# EAGLE design dasblinkenhat-controller-mk-1.1 (EAGLE 7.5.0)
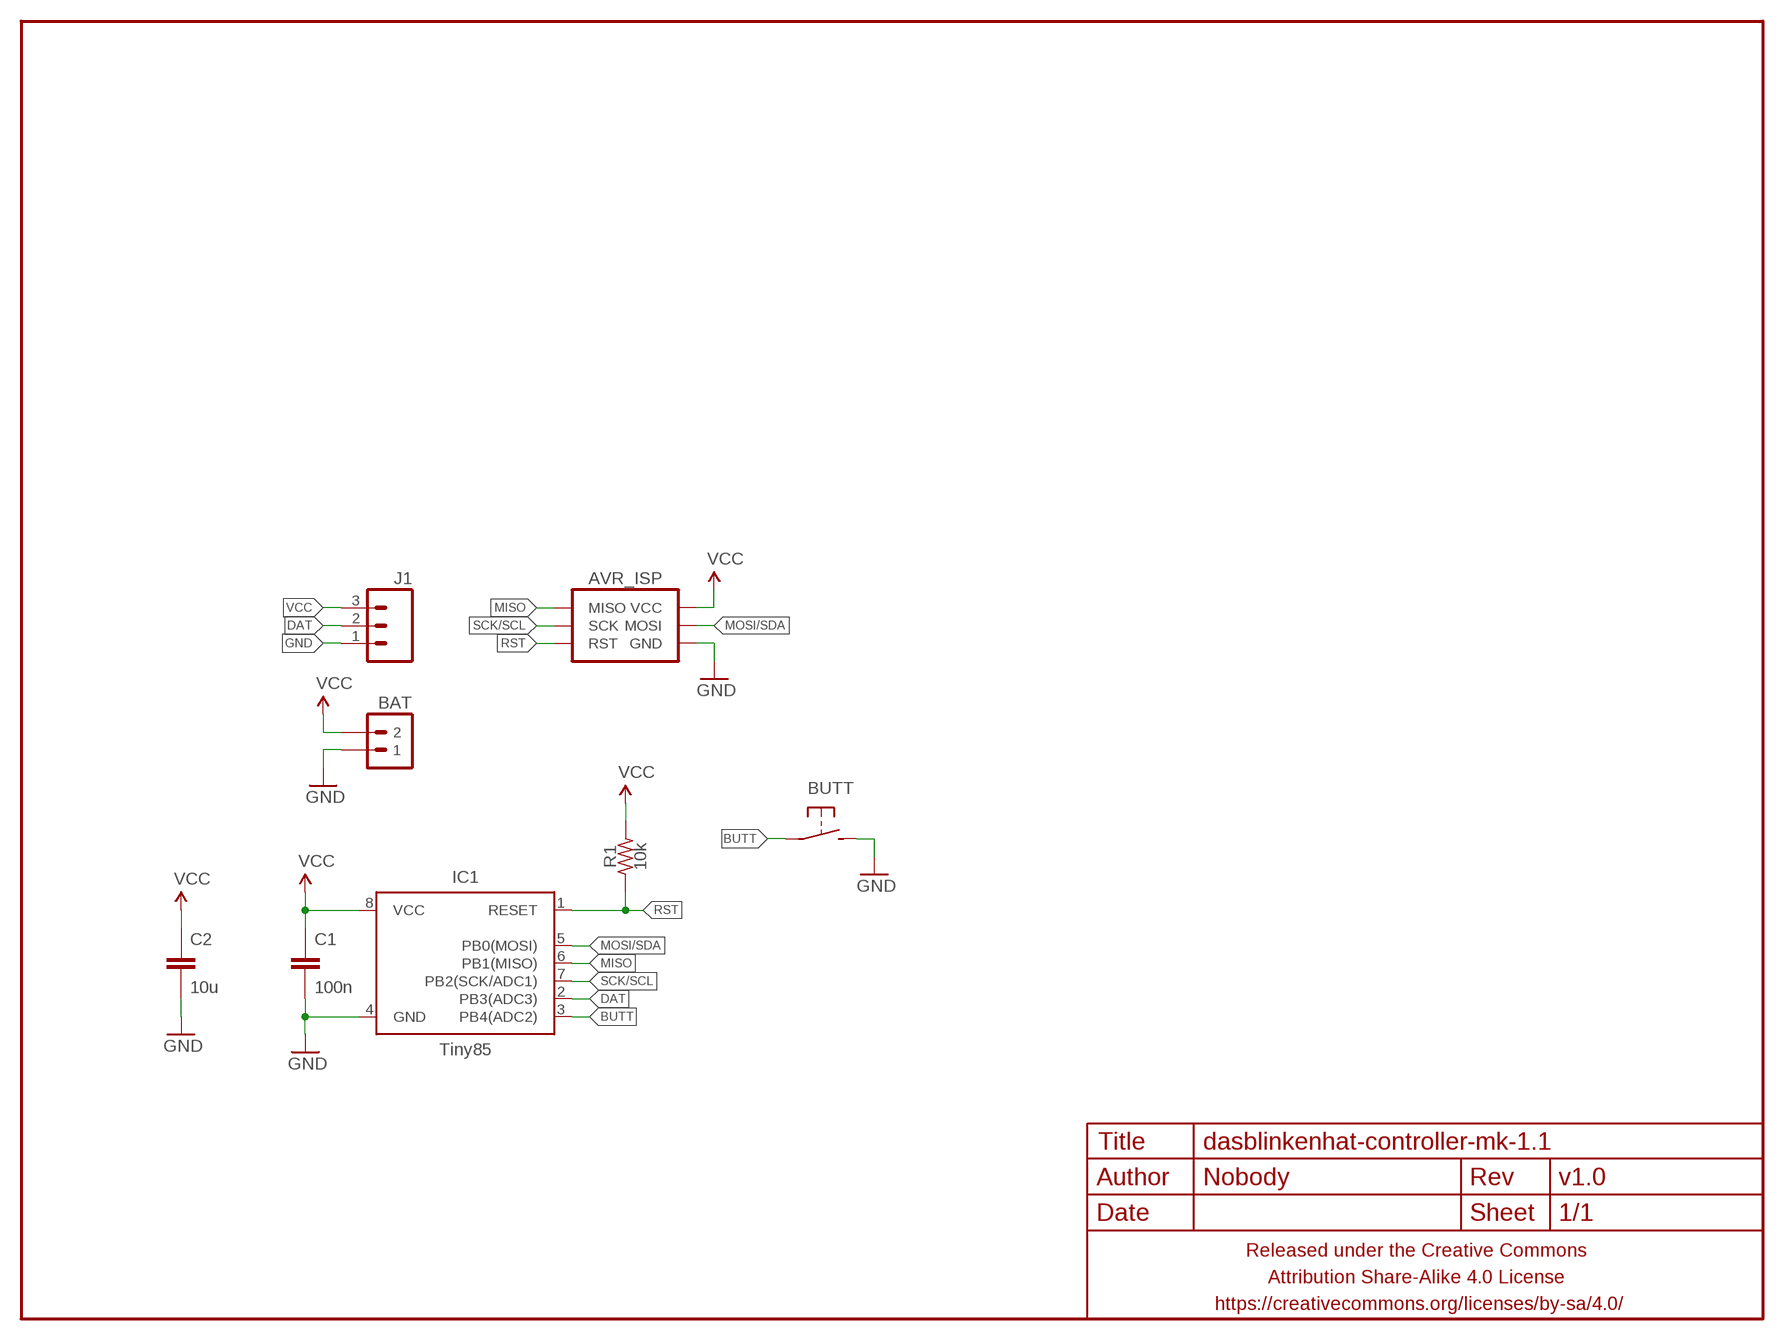
[diagram p0: schematic, sheet 1]

## Parts
AVR_ISP  AVR_SPI_PRG_6TESTPOINTS  [2X3_TEST_POINTS]
BAT  M02JST-2MM-SMT  [JST-2-SMD]
BUTT  DTS-6MM  SPST-NO-TACTSMD-TINY  [TACTILE-SWITCH-SMD]
C1  100n  CAPACITOR-CERAMICC0603  [C0603]
C2  10u  CAPACITOR-CERAMICC0805  [C0805]
FRAME1  FRAME-LETTERNO_PACKAGE  [DUMMY]
IC1  Tiny85  ATTINY45TINY85-20-SOICW  [SO08-EIAJ]
J1  M03JST-XH-RA-PTH  [JST-3-XH-RA-PTH]
R1  10k  RESISTORR0603  [R0603]

## Nets
BUTT: BUTT.A@1 BUTT.A@2 IC1.3(PB4(ADC2))
DAT: IC1.2(PB3(ADC3)) J1.2
GND: AVR_ISP.6(GND) BAT.2 BUTT.B@1 BUTT.B@2 C1.2 C2.2 IC1.4(GND) J1.1
MISO: AVR_ISP.1(MISO) IC1.6(PB1(MISO))
MOSI/SDA: AVR_ISP.4(MOSI) IC1.5(PB0(MOSI))
RST: AVR_ISP.5(RST) IC1.1(RESET) R1.1
SCK/SCL: AVR_ISP.3(SCK) IC1.7(PB2(SCK/ADC1))
VCC: AVR_ISP.2(VCC) BAT.1 C1.1 C2.1 IC1.8(VCC) J1.3 R1.2

## Library data of the parts
AVR_ISP = A_butts:AVR_SPI_PRG_6: AVR ISP 6 Pin This is the reduced ISP connector for AVR programming. Common on Arduino. This footprint will take up less PCB space and can be used with a 10-pin to 6-pin adapter such as SKU: BOB-08508 **Special note about "TEST_POINT" package. The stop mask is on the top side, so if you want your programming test points to be on the bottom of your board, make sure to place this package on the bottom side of the board. This also ensure that the orientation to program from the bottom side will be correct.
BAT = a_parts:M02: Standard 2-pin 0.1" header. Use with - straight break away headers ( PRT-00116) - right angle break away headers (PRT-00553) - swiss pins (PRT-00743) - machine pins (PRT-00117) - female headers (PRT-00115) Molex polarized connector foot print use with: PRT-08233 with associated crimp pins and housings. 2.54_SCREWTERM for use with PRT-10571. 3.5mm Screw Terminal footprints for PRT-08084 5mm Screw Terminal footprints for use with PRT-08433; PROD_ID: CONN-08352
BUTT = A_butts:SPST-NO-TACT
C1 C2 = A_butts:CAPACITOR-CERAMIC: CAPACITOR, European symbol
FRAME1 = a_parts:FRAME-LETTER: Schematic Frame Standard 8.5x11 US Letter frame; DESIGNER: Nobody; VERSION: v1.0
IC1 = A_butts:ATTINY45: Atmel 8-pin 2/4/8kB flash uC; PROD_ID: IC-09092; VALUE: Tiny85-20-SMT
J1 = a_parts:M03: Header 3 Standard 3-pin 0.1" header. Use with straight break away headers (SKU : PRT-00116), right angle break away headers (PRT-00553), swiss pins (PRT-00743), machine pins (PRT-00117), and female headers (PRT-00115). Molex polarized connector foot print use with SKU : PRT-08232 with associated crimp pins and housings.
R1 = A_butts:RESISTOR: RESISTOR, American symbol

## Board
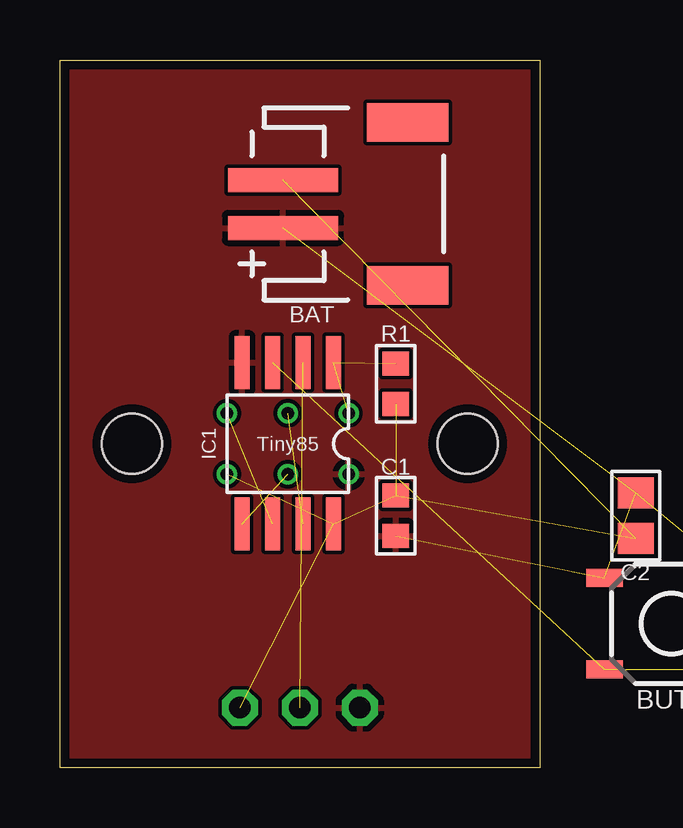
[diagram p1: board, top side]
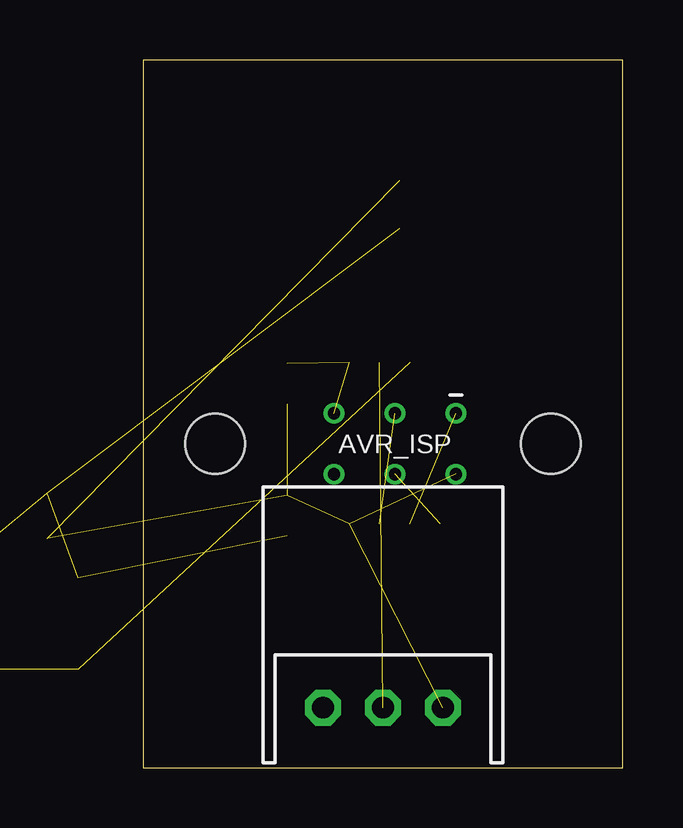
[diagram p2: board, bottom side, seen from below]

Size 20 x 29.5 mm. Coordinates in mm from the lower left corner, seen from the top.
Outline: 0,0 0,29.5 20,29.5 20,0 0,0
Copper layers (1*16): Top 0.0356mm / dielectric 1.5011mm / Bottom 0.0356mm
Design rules "LaenPCBOrder2": minimum track width 6mil, minimum drill 13mil, track to track 6mil, track to pad 6mil, pad to pad 6mil, via to via 6mil, smd to smd 6mil, copper to edge 15mil, drill to drill 6mil, minimum pad ring 7mil, minimum via ring 7mil, stop-mask expansion 3mil, vias tented up to drill 20mil, thermal gap 10mil
Holes 2.5 mm at 3,13.5 17,13.5

### Footprints (pad centres in the part's own frame; a part is rotated, then mirrored left to right if it is on the bottom)
2X3_TEST_POINTS = drill 0.508: 1 -2.54,-1.27; 2 -2.54,1.27; 3 0,-1.27; 4 0,1.27; 5 2.54,-1.27; 6 2.54,1.27
JST-2-SMD = smd 1 x 4.6: 1 -1,-3.7; 2 1,-3.7 | smd 1.6 x 3.4: NC1 -3.4,1.5; NC2 3.4,1.5
TACTILE-SWITCH-SMD = smd 1.524 x 0.762: A@1 -2.794,1.905; A@2 2.794,1.905; B@1 -2.794,-1.905; B@2 2.794,-1.905
C0603 = smd 1 x 1.1: 1 -0.85,0; 2 0.85,0
C0805 = smd 1.3 x 1.5: 1 -0.95,0; 2 0.95,0
SO08-EIAJ = smd 0.61 x 2.21: 1 -1.905,-3.378; 2 -0.635,-3.378; 3 0.635,-3.378; 4 1.905,-3.378; 5 1.905,3.353; 6 0.635,3.353; 7 -0.635,3.353; 8 -1.905,3.353
JST-3-XH-RA-PTH = drill 0.9 pad 1.5 octagon: 1 -2.5,0; 2 0,0; 3 2.5,0
R0603 = smd 1 x 1.1: 1 -0.85,0; 2 0.85,0

### Placement (x,y rotation side)
AVR_ISP  9.5,13.5 180 bottom
BAT  13,23.5 270 top
BUTT  25.5,6 180 top
C1  14,10.5 270 top
C2  24,10.5 90 top  (outside the outline)
FRAME1  0,-0.5 0 top
IC1  9.5,13.5 180 top
J1  10,2.5 0 bottom
R1  14,16 270 top

### Tracks (layer width: path | path; a pad name or v marks a point on that pad's centre or on a via)
BUTT  (2 unrouted)
DAT  (1 unrouted)
GND  (4 unrouted)
  pour Top: 0,0 0,29.5 20,29.5 20,0
MISO  (1 unrouted)
MOSI/SDA  (1 unrouted)
RST  (2 unrouted)
SCK/SCL  (1 unrouted)
VCC  (6 unrouted)